# Altium schematic sheet board_sch.SchDoc
size A3
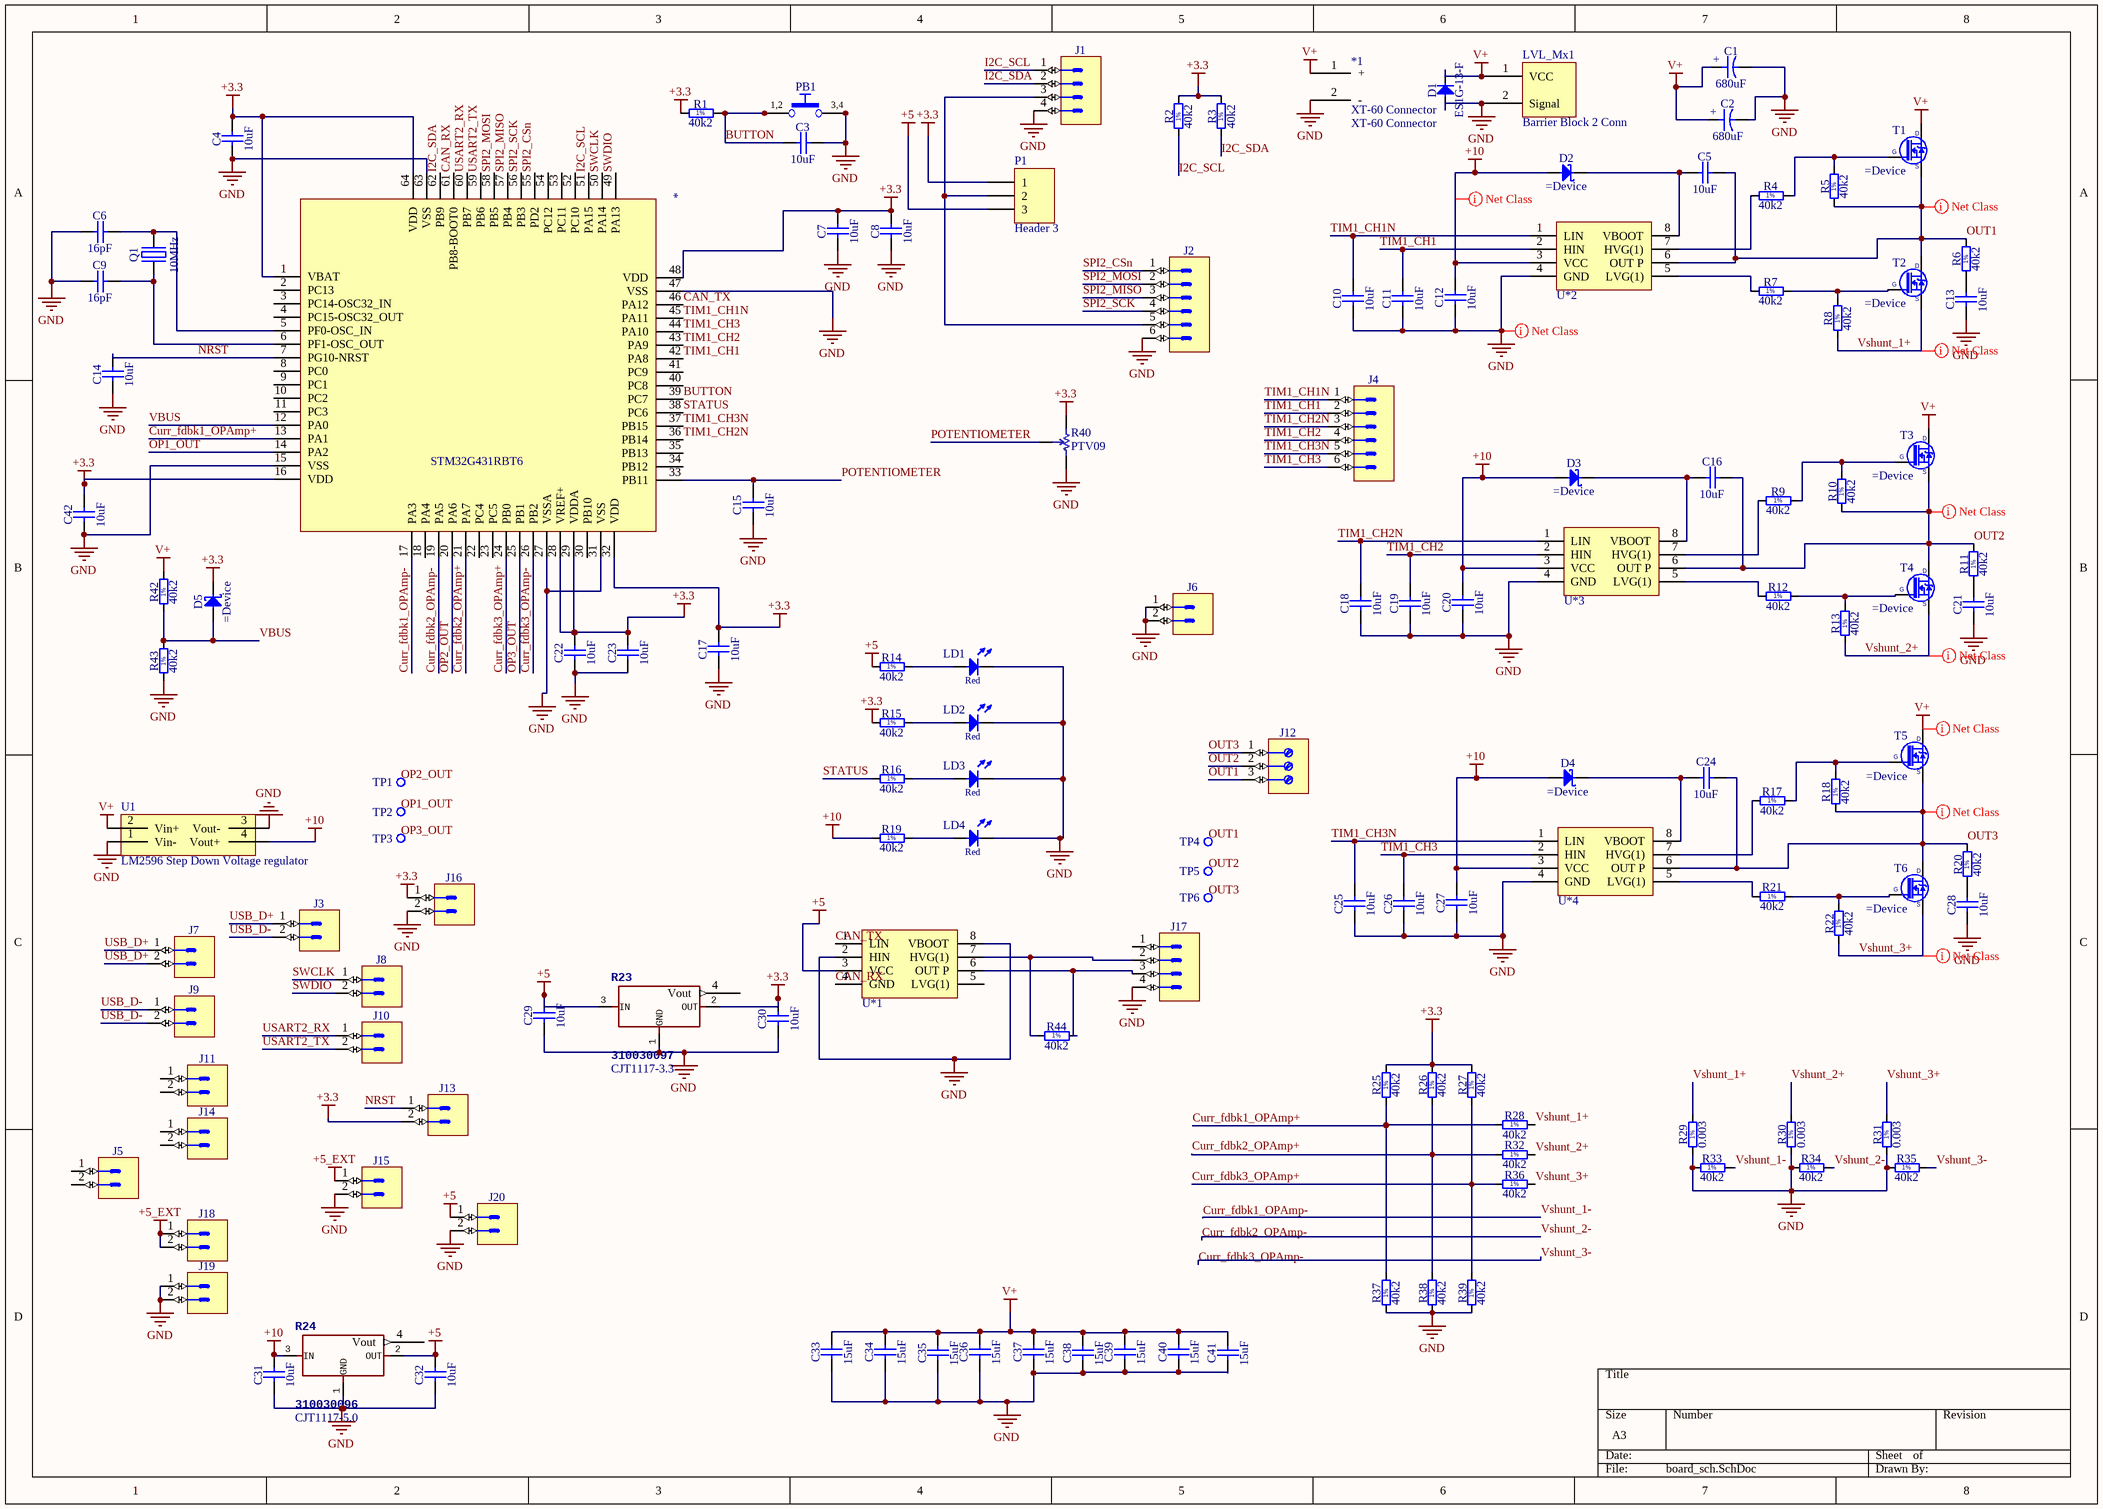
[diagram p0: board_sch.SchDoc]

## Parts
*  STM32G431RBT6  [STM-LQFP64_L]
*1  XT-60 Connector  [XT-60]
C1  680uF  [CAPAE1030X1020N]
C2  680uF  [CAPAE1030X1020N]
C3  10uF  [CAPC2012X135N]
C4  10uF  [CAPC2012X135N]
C5  10uF  [CAPC2012X135N]
C6  16pF  [CAPC2012X135N]
C7  10uF  [CAPC2012X135N]
C8  10uF  [CAPC2012X135N]
C9  16pF  [CAPC2012X135N]
C10  10uF  [CAPC2012X135N]
C11  10uF  [CAPC2012X135N]
C12  10uF  [CAPC2012X135N]
C13  10uF  [CAPC2012X135N]
C14  10uF  [CAPC2012X135N]
C15  10uF  [CAPC2012X135N]
C16  10uF  [CAPC2012X135N]
C17  10uF  [CAPC2012X135N]
C18  10uF  [CAPC2012X135N]
C19  10uF  [CAPC2012X135N]
C20  10uF  [CAPC2012X135N]
C21  10uF  [CAPC2012X135N]
C22  10uF  [CAPC2012X135N]
C23  10uF  [CAPC2012X135N]
C24  10uF  [CAPC2012X135N]
C25  10uF  [CAPC2012X135N]
C26  10uF  [CAPC2012X135N]
C27  10uF  [CAPC2012X135N]
C28  10uF  [CAPC2012X135N]
C29  10uF  [CAPC2012X135N]
C30  10uF  [CAPC2012X135N]
C31  10uF  [CAPC2012X135N]
C32  10uF  [CAPC2012X135N]
C33  15uF  [CAPC2012X135N]
C34  15uF  [CAPC2012X135N]
C35  15uF  [CAPC2012X135N]
C36  15uF  [CAPC2012X135N]
C37  15uF  [CAPC2012X135N]
C38  15uF  [CAPC2012X135N]
C39  15uF  [CAPC2012X135N]
C40  15uF  [CAPC2012X135N]
C41  15uF  [CAPC2012X135N]
C42  10uF  [CAPC2012X135N]
D1  ES1G-13-F  [DIOM5226X230N]
D2  (no value)  [SOD3716X135N]
D3  (no value)  [SOD3716X135N]
D4  (no value)  [SOD3716X135N]
D5  (no value)  [SOD3716X135N]
J1  KK®  [MOLEX_22-04-1041]  (value not drawn)
J2  KK®  [MOLEX_22-27-2061]  (value not drawn)
J3  Header 2  [SAMTEC_TSW-101-23-L-D]  (value not drawn)
J4  (no value)  [HARWIN_M22-F2010605]
J5  Header 2  [SAMTEC_TSW-101-23-L-D]  (value not drawn)
J6  Header 2  [HARWIN_M22-2010205]  (value not drawn)
J7  Header 2  [SAMTEC_TSW-101-23-L-D]  (value not drawn)
J8  Header 2  [SAMTEC_TSW-101-23-L-D]  (value not drawn)
J9  Header 2  [SAMTEC_TSW-101-23-L-D]  (value not drawn)
J10  Header 2  [SAMTEC_TSW-101-23-L-D]  (value not drawn)
J11  Header 2  [SAMTEC_TSW-101-23-L-D]  (value not drawn)
J12  Terminal  [WIELAND_25.161.0353.0]  (value not drawn)
J13  Header 2  [SAMTEC_TSW-101-23-L-D]  (value not drawn)
J14  Header 2  [SAMTEC_TSW-101-23-L-D]  (value not drawn)
J15  Header 2  [SAMTEC_TSW-101-23-L-D]  (value not drawn)
J16  Header 2  [SAMTEC_TSW-101-23-L-D]  (value not drawn)
J17  KK®  [MOLEX_22-04-1041]  (value not drawn)
J18  Header 2  [SAMTEC_TSW-101-23-L-D]  (value not drawn)
J19  Header 2  [SAMTEC_TSW-101-23-L-D]  (value not drawn)
J20  Header 2  [SAMTEC_TSW-101-23-L-D]  (value not drawn)
LD1  Red  [LED_5MM_RED_1C-2A]  (value not drawn)
LD2  Red  [LED_5MM_RED_1C-2A]  (value not drawn)
LD3  Red  [LED_5MM_RED_1C-2A]  (value not drawn)
LD4  Red  [LED_5MM_RED_1C-2A]  (value not drawn)
LVL_Mx1  Barrier Block 2 Conn  [2 Barrier Block 5mm]
P1  Header 3  [HDR1X3]
PB1  Push Button  [PB_TYCO_FSM2JSMA]  (value not drawn)
Q1  10MHz  [XTAL1160X490X430]
R1  40k2  [RESC2012X60N]
R2  40k2  [RESC2012X60N]
R3  40k2  [RESC2012X60N]
R4  40k2  [RESC2012X60N]
R5  40k2  [RESC2012X60N]
R6  40k2  [RESC2012X60N]
R7  40k2  [RESC2012X60N]
R8  40k2  [RESC2012X60N]
R9  40k2  [RESC2012X60N]
R10  40k2  [RESC2012X60N]
R11  40k2  [RESC2012X60N]
R12  40k2  [RESC2012X60N]
R13  40k2  [RESC2012X60N]
R14  40k2  [RESC2012X60N]
R15  40k2  [RESC2012X60N]
R16  40k2  [RESC2012X60N]
R17  40k2  [RESC2012X60N]
R18  40k2  [RESC2012X60N]
R19  40k2  [RESC2012X60N]
R20  40k2  [RESC2012X60N]
R21  40k2  [RESC2012X60N]
R22  40k2  [RESC2012X60N]
R23  310030097  MPN: CJT1117-3.3  [SOT-223]
R24  310030096  MPN: CJT1117-5.0  [SOT-223]
R25  40k2  [RESC2012X60N]
R26  40k2  [RESC2012X60N]
R27  40k2  [RESC2012X60N]
R28  40k2  [RESC2012X60N]
R29  0.003  [RESC6432X120N]
R30  0.003  [RESC6432X120N]
R31  0.003  [RESC6432X120N]
R32  40k2  [RESC2012X60N]
R33  40k2  [RESC2012X60N]
R34  40k2  [RESC2012X60N]
R35  40k2  [RESC2012X60N]
R36  40k2  [RESC2012X60N]
R37  40k2  [RESC2012X60N]
R38  40k2  [RESC2012X60N]
R39  40k2  [RESC2012X60N]
R40  PTV09  [PTV09A-1x30]
R42  40k2  [RESC2012X60N]
R43  40k2  [RESC2012X60N]
R44  40k2  [RESC2012X60N]
T1  (no value)  [TO254P1524X483-3N-R750X1016]
T2  (no value)  [TO254P1524X483-3N-R750X1016]
T3  (no value)  [TO254P1524X483-3N-R750X1016]
T4  (no value)  [TO254P1524X483-3N-R750X1016]
T5  (no value)  [TO254P1524X483-3N-R750X1016]
T6  (no value)  [TO254P1524X483-3N-R750X1016]
TP1  Test Point  [VERO_20-313145]  (value not drawn)
TP2  Test Point  [VERO_20-313145]  (value not drawn)
TP3  Test Point  [VERO_20-313145]  (value not drawn)
TP4  Test Point  [VERO_20-313145]  (value not drawn)
TP5  Test Point  [VERO_20-313145]  (value not drawn)
TP6  Test Point  [VERO_20-313145]  (value not drawn)
U1  LM2596 Step Down Voltage regulator  [LM2596 DC-DC]
U*1  L6387ED  [SOIC127P600X175-8N]  (value not drawn)
U*2  L6387ED  [SOIC127P600X175-8N]  (value not drawn)
U*3  L6387ED  [SOIC127P600X175-8N]  (value not drawn)
U*4  L6387ED  [SOIC127P600X175-8N]  (value not drawn)

## Nets
+3.3: *.1(VBAT) *.16(VDD) *.28(VREF+) *.29(VDDA) *.32(VDD) *.48(VDD) *.64(VDD) C4.2 C7.2 C8.2 C17.2 C22.2 C23.2 C30.2 C42.2 D5.1(C) J13.2 J16.1 P1.1 R1.1 R2.2 R3.2 R15.1 R23.2(OUT) R25.2 R26.2 R27.2 R40.3
+5: C29.2 C32.2 J20.1 P1.3 R14.1 R23.3(IN) R24.2(OUT) U*1.3(VCC)
+5_EXT: J15.1 J18.1 J18.2
+10: C12.2 C20.2 C27.2 C31.2 D2.2(A) D3.2(A) D4.2(A) R19.1 R24.3(IN) U1.4(Vout+) U*2.3(VCC) U*3.3(VCC) U*4.3(VCC)
GND: *.15(VSS) *.27(VSSA) *.31(VSS) *.47(VSS) *.63(VSS) *1.2(-) C1.2 C2.2 C3.2 C4.1 C6.1 C7.1 C8.1 C9.1 C10.1 C11.1 C12.1 C13.1 C14.1 C15.1 C17.1 C18.1 C19.1 C20.1 C21.1 C22.1 C23.1 C25.1 C26.1 C27.1 C28.1 C29.1 C30.1 C31.1 C32.1 C33.1 C34.1 C35.1 C36.1 C37.1 C38.1 C39.1 C40.1 C41.1 C42.1 D1.2(A) J1.4 J2.6 J6.1 J6.2 J15.2 J16.2 J17.4 J19.1 J19.2 J20.2 LD1.1(C) LD2.1(C) LD3.1(C) LD4.1(C) LVL_Mx1.2(Signal) PB1.3 PB1.4 R23.1(GND) R24.1(GND) R29.1 R30.1 R31.1 R33.1 R34.1 R35.1 R37.1 R38.1 R39.1 R40.1 R43.1 U1.1(Vin-) U1.3(Vout-) U*1.2(HIN) U*1.8(VBOOT) U*2.4(GND) U*3.4(GND) U*4.4(GND)
V+: *1.1(+) C1.1 C2.1 C33.2 C34.2 C35.2 C36.2 C37.2 C38.2 C39.2 C40.2 C41.2 D1.1(C) LVL_Mx1.1(VCC) R42.2 T1.2(D) T3.2(D) T5.2(D) U1.2(Vin+)
BUTTON: *.39(PC7) C3.1 PB1.1 PB1.2 R1.2
CAN_RX: *.61(PB8-BOOT0) U*1.4(GND)
CAN_TX: *.46(PA12) U*1.1(LIN)
Curr_fdbk1_OPAmp+: *.13(PA1) R25.1 R28.1 R37.2
Curr_fdbk1_OPAmp-: *.17(PA3) R33.2  [also labelled Vshunt_1-]
Curr_fdbk2_OPAmp+: *.21(PA7) R26.1 R32.1 R38.2
Curr_fdbk2_OPAmp-: *.19(PA5) R34.2  [also labelled Vshunt_2-]
Curr_fdbk3_OPAmp+: *.24(PB0) R27.1 R36.1 R39.2
Curr_fdbk3_OPAmp-: *.26(PB2) R35.2  [also labelled Vshunt_3-]
I2C_SCL: *.51(PA15) J1.1 R2.1
I2C_SDA: *.62(PB9) J1.2 R3.1
NRST: *.7(PG10-NRST) C14.2 J13.1
OP1_OUT: *.14(PA2) TP2.1
OP2_OUT: *.20(PA6) TP1.1
OP3_OUT: *.25(PB1) TP3.1
OUT1: C5.2 J12.3 R5.1 R6.2 T1.3(S) T2.2(D) TP4.1 U*2.6(OUT_P)
OUT2: C16.2 J12.2 R10.1 R11.2 T3.3(S) T4.2(D) TP5.1 U*3.6(OUT_P)
OUT3: C24.2 J12.1 R18.1 R20.2 T5.3(S) T6.2(D) TP6.1 U*4.6(OUT_P)
POTENTIOMETER: *.33(PB11) C15.2 R40.2
SPI2_CSn: *.55(PD2) J2.1
SPI2_MISO: *.57(PB4) J2.3
SPI2_MOSI: *.58(PB5) J2.2
SPI2_SCK: *.56(PB3) J2.4
STATUS: *.38(PC6) R16.1
SWCLK: *.50(PA14) J8.1
SWDIO: *.49(PA13) J8.2
TIM1_CH1: *.42(PA8) C11.2 J4.2 U*2.2(HIN)
TIM1_CH1N: *.45(PA11) C10.2 J4.1 U*2.1(LIN)
TIM1_CH2: *.43(PA9) C19.2 J4.4 U*3.2(HIN)
TIM1_CH2N: *.36(PB14) C18.2 J4.3 U*3.1(LIN)
TIM1_CH3: *.44(PA10) C26.2 J4.6 U*4.2(HIN)
TIM1_CH3N: *.37(PB15) C25.2 J4.5 U*4.1(LIN)
USART2_RX: *.60(PB7) J10.1
USART2_TX: *.59(PB6) J10.2
USB_D+: J3.1 J7.1 J7.2
USB_D-: J3.2 J9.1 J9.2
VBUS: *.12(PA0) D5.2(A) R42.1 R43.2
Vshunt_1+: R8.1 R28.2 R29.2 T2.3(S)
Vshunt_2+: R13.1 R30.2 R32.2 T4.3(S)
Vshunt_3+: R22.1 R31.2 R36.2 T6.3(S)
Net*_5: *.5(PF0-OSC_IN) C6.2 Q1.2(OSC2)
Net*_6: *.6(PF1-OSC_OUT) C9.2 Q1.1(OSC1)
NetC5_1: C5.1 D2.1(C) U*2.8(VBOOT)
NetC13_2: C13.2 R6.1
NetC16_1: C16.1 D3.1(C) U*3.8(VBOOT)
NetC21_2: C21.2 R11.1
NetC24_1: C24.1 D4.1(C) U*4.8(VBOOT)
NetC28_2: C28.2 R20.1
NetJ1_3: J1.3 J2.5 P1.2
NetJ17_2: J17.2 R44.1 U*1.7(HVG(1))
NetJ17_3: J17.3 R44.2 U*1.6(OUT_P)
NetLD1_2: LD1.2(A) R14.2
NetLD2_2: LD2.2(A) R15.2
NetLD3_2: LD3.2(A) R16.2
NetLD4_2: LD4.2(A) R19.2
NetR4_1: R4.1 U*2.7(HVG(1))
NetR4_2: R4.2 R5.2 T1.1(G)
NetR7_1: R7.1 U*2.5(LVG(1))
NetR7_2: R7.2 R8.2 T2.1(G)
NetR9_1: R9.1 U*3.7(HVG(1))
NetR9_2: R9.2 R10.2 T3.1(G)
NetR12_1: R12.1 U*3.5(LVG(1))
NetR12_2: R12.2 R13.2 T4.1(G)
NetR17_1: R17.1 U*4.7(HVG(1))
NetR17_2: R17.2 R18.2 T5.1(G)
NetR21_1: R21.1 U*4.5(LVG(1))
NetR21_2: R21.2 R22.2 T6.1(G)

Not connected (* = marked no-connect by the designer): * 2(PC13) 3(PC14-OSC32_IN) 4(PC15-OSC32_OUT) 8(PC0) 9(PC1) 10(PC2) 11(PC3) 18(PA4) 22(PC4) 23(PC5) 30(PB10) 34(PB12) 35(PB13) 40(PC8) 41(PC9) 52(PC10) 53(PC11) 54(PC12); J5 1 2; J11 1 2; J14 1 2; J17 1; R23 4(Vout); R24 4(Vout); U*1 5(LVG(1))

## Layout directives
net class Power: OUT1, OUT2, OUT3, V+, Vshunt_1+, Vshunt_2+, Vshunt_3+
net class GND: GND
net class +10V: +10

## Notes on the sheet
- (in symbol CAE1030-1020_680UF_4V_20%) +
- (in symbol PB_TYCO_FSM2JSMA) 1,2; 3,4
- (in symbol R0805_40K2_1%_0.125W_100PPM) 1%
- (in symbol R2512_390K_1%_3W_100PPM_TYCO_3522) 1%

## Library data of the parts
*1 = XT-60 Connector: Manufacturer: POLOLU; Manufacturer Part Number: XT60 YELLOW; Unit: pcs; SuppliedAmount: 0; MinAmount: 1; Type of robotics accessories: power connector; Maximum current: 65A; Information: Product is not a working device, but only component; Supplier 1: TME; Category: Power Supply Modules; Stock 1: 29; Pricing 1: 1=2.08, 10=1.95 (USD); Weight: 7.267; Multiples: 1; Number of pins: 2; Colour: yellow; Price Type: NET; ComponentLink1URL: http://static.tme.eu/products_pics/8/b/5/8b5040a8a5baf3e0e67386c2e3a9b903/913.jpg; ComponentLink1Description: http://static.tme.eu/products_pics/8/b/5/8b5040a8a5baf3e0e67386c2e3a9b903/913.jpg; Supplier Part Number 1: XT-60 Connector
C1 C2 = CAE1030-1020_680UF_4V_20%: Polarised capacitor; Part Description: Aluminum Electrolytic SMT Capacitor; Manufacturer: PANASONIC; Manufacturer Part Number: 4SVP680M; Voltage: 4V; Tolerance: ±20%; Part Number: CAE1030-1020_680UF_4V_20%; Component Kind: Standard; Component Type: Standard; Pin Count: 2; Value: 680uF; Status: Not Recommended; Case: F8; Mounted: Yes; Socket: No; SMD: Yes; Sense: No; ComponentHeight: 10.2mm; HelpURL: \\cern.ch\dfs\Applications\Altium\Datasheets\CAE_PANASONIC_SVP.pdf; Author: CERN DEM MR; CreateDate: 23.03.2016; LatestRevisionDate: 23.03.2016
C3-C5 C7 C8 C10-C32 C42 = CC0805_10UF_10V_10%_X7R: Non-polarised capacitor; Part Description: SMD Multilayer Chip Ceramic Capacitor; Manufacturer: GENERIC; Manufacturer1 Part Number: GRM21BR71A106KE51L; Voltage: 10V; TC: X7R; Tolerance: ±10%; Part Number: CC0805_10UF_10V_10%_X7R; Component Kind: Standard; Component Type: Standard; Pin Count: 2; Value: 10uF; Status: Preferred; Manufacturer Part Number: CC0805_10UF_10V_10%_X7R; Case: 0805; Mounted: Yes; Socket: No; SMD: Yes; Sense: No; Manufacturer1 Example: MURATA; Manufacturer1 ComponentHeight: 1.35mm; HelpURL: \\cern.ch\dfs\Applications\Altium\Datasheets\CC0805_X7R_MURATA.pdf; Author: CERN DEM JLC; CreateDate: 30.04.2012; LatestRevisionDate: 30.04.2012
C6 C9 = CC0805_10UF_10V_10%_X7R: Non-polarised capacitor; Part Description: SMD Multilayer Chip Ceramic Capacitor; Manufacturer: GENERIC; Manufacturer1 Part Number: GRM21BR71A106KE51L; Value: 10uF; Voltage: 10V; TC: X7R; Tolerance: ±10%; Part Number: CC0805_10UF_10V_10%_X7R; Component Kind: Standard; Component Type: Standard; Pin Count: 2; Status: Preferred; Manufacturer Part Number: CC0805_10UF_10V_10%_X7R; Case: 0805; Mounted: Yes; Socket: No; SMD: Yes; Sense: No; Manufacturer1 Example: MURATA; Manufacturer1 ComponentHeight: 1.35mm; HelpURL: \\cern.ch\dfs\Applications\Altium\Datasheets\CC0805_X7R_MURATA.pdf; Author: CERN DEM JLC; CreateDate: 30.04.2012; LatestRevisionDate: 30.04.2012
C33-C41 = CC0805_1.2PF_50V_0.25PF_NP0: Non-polarised capacitor; Part Description: SMD Multilayer Chip Ceramic Capacitor; Manufacturer: GENERIC; Manufacturer1 Part Number: 223886114128; Value: 1.2pF; Voltage: 50V; TC: C0G/NP0; Tolerance: ±0.25pF; Part Number: CC0805_1.2PF_50V_0.25PF_NP0; Component Kind: Standard; Component Type: Standard; Pin Count: 2; Status: Not Recommended; Manufacturer Part Number: CC0805_1.2PF_50V_0.25PF_NP0; Case: 0805; Mounted: Yes; Socket: No; SMD: Yes; Sense: No; Manufacturer1 Example: PHYCOMP; Manufacturer1 ComponentHeight: 1.35mm; HelpURL: \\cern.ch\dfs\Applications\Altium\Datasheets\CC0805_NP0_PHYCOMP.pdf; Author: CERN DEM JLC; CreateDate: 03.12.2007; LatestRevisionDate: 03.12.2007
D1 = ES1G-13-F: Diode; Part Description: Surface Mount Super-Fast Rectifier; Manufacturer: DIODES INCORPORATED; Voltage: 400V; Power: 1A; PressFit: No; Bonding: No; Part Number: ES1G-13-F; Component Kind: Standard; Component Type: Standard; Device: ES1G-13-F; PackageDescription: DO-214-AC/SMA Diode, Molded Body; 5.195mm L X 2.605mm W X 2.30mm H, IPC Medium Density; Manufacturer Part Number: ES1G-13-F; Pin Count: 2; Case: DO-214AC; Mounted: Yes; Socket: No; SMD: Yes; Sense: No; ComponentHeight: 2.30mm; HelpURL: \\cern.ch\dfs\Applications\Altium\Datasheets\ES1G-13-F.pdf; Author: CERN DEM JLC; CreateDate: 15.09.2014; LatestRevisionDate: 15.09.2014
D2-D5 = Diode Schottky: Schottky Diode
J1 J17 = MOLEX_22-04-1041: Connector 4 Male; Part Description: 2.5mm (.100") Pitch KK® Wire-to-Board Header, Vertical, with Friction Lock, 4 Circuits, Tin (Sn) Plating; Manufacturer: MOLEX; PressFit: No; Part Number: MOLEX_22-04-1041; Component Kind: Standard; Component Type: Standard; Pin Count: 4; Family: KK®; Mounted: Yes; Socket: No; SMD: No; Sense: No; Status: None; Manufacturer Part Number: 22-04-1041; ComponentHeight: 11.7mm; HelpURL: \\cern.ch\dfs\Applications\Altium\Datasheets\MOLEX_22-04-1041.pdf; Author: CERN DEM JLC; CreateDate: 09.02.2012; LatestRevisionDate: 09.02.2012
J2 = MOLEX_22-27-2061: Connector 6 Male; Part Description: 2.54mm (.100") Pitch KK® Wire-to-Board Header, Vertical, with Friction Lock, 6 Circuits, Tin (Sn) Plating; Manufacturer: MOLEX; PressFit: No; Part Number: MOLEX_22-27-2061; Component Kind: Standard; Component Type: Standard; Pin Count: 6; Family: KK®; Mounted: Yes; Socket: No; SMD: No; Sense: No; Status: None; Manufacturer Part Number: 22-27-2061; ComponentHeight: 11.7mm; HelpURL: \\cern.ch\dfs\Applications\Altium\Datasheets\MOLEX_22-27-2061.pdf; Author: CERN DEM JMW; CreateDate: 30.11.2011; LatestRevisionDate: 30.11.2011
J3 J5 J7-J11 J13-J16 J18-J20 = SAMTEC_TSW-101-23-L-D: Connector 2 Male; Part Description: 2 Contacts, Pitch 2.54mm, Dual Row  Through Mount Straight Header (Post Lead 5.84mm, Tail Lead 2.92mm, Insulator 2.54mm); Manufacturer: SAMTEC; PressFit: No; Part Number: SAMTEC_TSW-101-23-L-D; Component Kind: Standard; Component Type: Standard; Pin Count: 2; Family: Header 2; Mounted: Yes; Socket: No; Sense: No; SMD: No; Status: None; Manufacturer Part Number: TSW-101-23-L-D; ComponentHeight: 8.38mm; HelpURL: \\cern.ch\dfs\Applications\Altium\Datasheets\SAMTEC_TSW-101-23-L-D.pdf; Author: CERN DEM MR; CreateDate: 08.03.2017; LatestRevisionDate: 08.03.2017
J4 = HARWIN_M22-F2010605: Connector 6 Male; Part Description: 6 Contacts - Pitch 2mm - Single Row Through Mount Straight Header (Post Lead = 3.5mm, Tail Lead 3.4mm, Insulator 1.5mm); Manufacturer: HARWIN; PressFit: No; Part Number: HARWIN_M22-F2010605; Component Kind: Standard; Component Type: Standard; Pin Count: 6; Mounted: Yes; Socket: No; SMD: No; Sense: No; Status: None; Manufacturer Part Number: M22-F2010605; ComponentHeight: 5mm; HelpURL: \\cern.ch\dfs\Applications\Altium\Datasheets\HARWIN_M22-F2010605.pdf; Author: CERN DEM JLC; CreateDate: 14.09.2011; LatestRevisionDate: 06.12.2012
J6 = HARWIN_M22-2010205: Connector 2 Male; Part Description: 2 Contacts - Pitch 2mm - Single Row Through Mount Straight Header (Post Lead = 3.5mm, Tail Lead 3.4mm, Insulator 1.5mm); Manufacturer: HARWIN; PressFit: No; Part Number: HARWIN_M22-2010205; Component Kind: Standard; Component Type: Standard; Pin Count: 2; Family: Header 2; Mounted: Yes; Socket: No; SMD: No; Sense: No; Status: None; Manufacturer Part Number: M22-2010205; ComponentHeight: 5mm; HelpURL: \\cern.ch\dfs\Applications\Altium\Datasheets\HARWIN_M22-2010205.pdf; Author: CERN DEM JLC; CreateDate: 14.04.2015; LatestRevisionDate: 14.04.2015
J12 = WIELAND_25.161.0353.0: Terminal Block, 3 Positions, Screw Connection; Part Description: 16A 250VAC 3 Way PCB Terminal Block, Pitch 5mm, Screw Connection, Wire Size Max: 2.5mm²; PressFit: No; Part Number: WIELAND_25.161.0353.0; Component Kind: Standard; Component Type: Standard; Pin Count: 3; Family: Terminal; Mounted: Yes; Socket: No; SMD: No; Sense: No; Status: None; Manufacturer: WIELAND; Manufacturer Part Number: 25.161.0353.0; ComponentHeight: 15mm; HelpURL: \\cern.ch\dfs\Applications\Altium\Datasheets\WIELAND_25.161.0353.0.pdf; Author: CERN DEM JLC; CreateDate: 02.06.2009; LatestRevisionDate: 02.06.2009
LD1-LD4 = LED_AVAGO_HLMP-3301: LED Red 1C 2A; Part Description: 5mm High Efficiency Red LED; Manufacturer: AVAGO TECHNOLOGIES; PressFit: No; Bonding: No; Part Number: LED_AVAGO_HLMP-3301; Component Kind: Standard; Component Type: Standard; Color: Red; PackageDescription: LED, Red, Body Dia. 5.08mm, Pin spacing 2.54mm; Manufacturer Part Number: HLMP-3301; Pin Count: 2; Mounted: Yes; Socket: No; SMD: No; Sense: No; ComponentHeight: 9.19mm(min); HelpURL: \\cern.ch\dfs\Applications\Altium\Datasheets\LED_AVAGO_HLMP-3301.pdf; Author: CERN DEM JLC; CreateDate: 12.06.2008; LatestRevisionDate: 17.03.2010
LVL_Mx1 = Barrier Block 2 Conn_1
P1 = Header 3: Header, 3-Pin; LatestRevisionDate: 17-Jul-2002; LatestRevisionNote: Re-released for DXP Platform.; Publisher: Altium Limited
PB1 = PB_TYCO_FSM2JSMA: Push-Button Switch SPDT; Part Description: 12VDC 50mA SPST Tactile  Push-Button Switch; Manufacturer: TYCO ELECTRONICS; Manufacturer Part Number: FSM2JSMA or  2-1437565-7; PressFit: No; Part Number: PB_TYCO_FSM2JSMA; Component Kind: Standard; Component Type: Standard; Pin Count: 4; PackageDescription: Body 6mm x 6mm, Surface Mount Tactile Switches, TYCO ALCOSWITCH FSMJSMA Series; Family: Push Button; Mounted: Yes; Socket: No; SMD: Yes; Sense: No; Status: None; ComponentHeight: 4.59mm; HelpURL: \\cern.ch\dfs\Applications\Altium\Datasheets\PB_TYCO_FSM2JSMA.pdf; Author: CERN DEM JLC; CreateDate: 08.09.2008; LatestRevisionDate: 21.06.2012
Q1 = XTAL_10MHZ_IQD_LFXTAL003166: Quartz Crystal; Part Description: Tolerance:± 30ppm, Stability:± 50ppm, -10°C to +60°C, 16pF, Surface Mount Quartz Crystal, HC49/4HSMX Series; Manufacturer: IQD FREQUENCY PRODUCTS; PressFit: No; Bonding: No; Part Number: XTAL_10MHZ_IQD_LFXTAL003166; Component Kind: Standard; Component Type: Standard; PackageDescription: HC49/4H SMX Case, SMD Cristal, Body 11.6x4.9mm; Value: 10MHz; Manufacturer Part Number: LF XTAL003166; Pin Count: 2; Mounted: Yes; Socket: No; SMD: Yes; Sense: No; ComponentHeight: 4.3mm; HelpURL: \\cern.ch\dfs\Applications\Altium\Datasheets\XTAL_IQD_LFXTAL003166.pdf; Author: CERN DEM JLC; CreateDate: 19.04.2012; LatestRevisionDate: 07.11.2016
R1-R22 R25-R28 R32-R39 R42-R44 = R0805_40K2_1%_0.125W_100PPM: Resistor - 1%; Part Description: Thick Film Chip Resistor; Manufacturer: VISHAY; Manufacturer1 Part Number: CRCW080540K2FKEA; Power: 0.125W; TC: ±100ppm/°C; PressFit: No; Part Number: R0805_40K2_1%_0.125W_100PPM; Component Kind: Standard; Component Type: Standard; Pin Count: 2; Value: 40k2; Status: None; Tolerance: ±1%; Manufacturer Part Number: R0805_40K2_1%_0.125W_100PPM; Case: 0805; Mounted: Yes; Sense: No; Socket: No; SMD: Yes; Manufacturer1 Example: VISHAY; Manufacturer1 ComponentHeight: 0.6mm; HelpURL: \\cern.ch\dfs\Applications\Altium\Datasheets\R2512_VISHAY_CRCW0805.pdf; Author: CERN DEM JLC; CreateDate: 18.04.2013; LatestRevisionDate: 18.04.2013
R23 = PMIC-CJT1117-3.3(SOT223)
R24 = PMIC-CJT1117-5.0(SOT223)
R29-R31 = R2512_390K_1%_3W_100PPM_TYCO_3522: Resistor - 1%; Part Description: SMD Power Resistor; Manufacturer: TYCO; Manufacturer Part Number: 1-2176232-2 (3522390KFT); Value: 390k; Power: 3W; TC: ±100ppm/°C; PressFit: No; Part Number: R2512_390K_1%_3W_100PPM_TYCO_3522; Component Kind: Standard; Component Type: Standard; Pin Count: 2; Status: None; Tolerance: ±1%; Case: 2512; Mounted: Yes; Sense: No; Socket: No; SMD: Yes; ComponentHeight: 1.2mm; HelpURL: \\cern.ch\dfs\Applications\Altium\Datasheets\R2512_TYCO_3522.pdf; Author: CERN DEM JLC; CreateDate: 12.07.2017; LatestRevisionDate: 12.07.2017
R40 = PTV09: PTV09 Series - 9 mm Potentiometer
T1 T2 = N-MOSFET-DZ 1G 2D 3S: N-CHANNEL MOSFET WITH ZENER DIODE; pin to pad: 2>3 3>2
T3-T6 = N-MOSFET-DZ 1G 2D 3S: N-CHANNEL MOSFET WITH ZENER DIODE
TP1-TP6 = VERO_20-313145: Part Description: Black Bead PCB Terminal Test Pin for 2.4mm PCB Thickness (1.32mm Hole); Manufacturer: VERO TECHNOLOGIES; PressFit: No; Part Number: VERO_20-313145; Component Kind: Standard; Component Type: Standard; Pin Count: 1; Family: Test Point; Mounted: Yes; Socket: No; SMD: No; Sense: No; Status: None; Manufacturer Part Number: 20-313145; ComponentHeight: 5.3mm; HelpURL: \\cern.ch\dfs\Applications\Altium\Datasheets\VERO_20-313145.pdf; Author: CERN DEM JLC; CreateDate: 15.07.2013; LatestRevisionDate: 15.07.2013
U1 = LM2596 Step Down Board